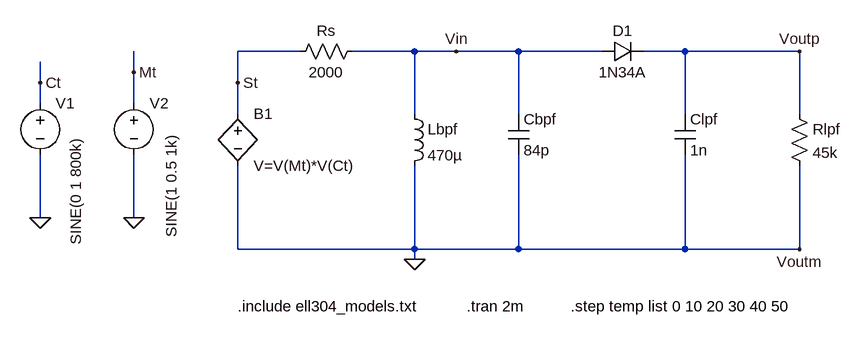
[diagram p0: schematic exmp2.asc]
exmp2.asc, the LTspice schematic file:
Version 4
SHEET 1 1368 680
WIRE 528 16 432 16
WIRE 704 16 608 16
WIRE 768 16 704 16
WIRE 864 16 768 16
WIRE 992 16 864 16
WIRE 1120 16 1056 16
WIRE 1296 16 1120 16
WIRE 272 48 272 16
WIRE 128 64 128 32
WIRE 432 64 432 16
WIRE 128 96 128 64
WIRE 272 96 272 48
WIRE 432 112 432 64
WIRE 704 112 704 16
WIRE 864 112 864 16
WIRE 1120 112 1120 16
WIRE 1296 112 1296 16
WIRE 128 272 128 176
WIRE 272 272 272 176
WIRE 432 320 432 192
WIRE 704 320 704 192
WIRE 704 320 432 320
WIRE 864 320 864 176
WIRE 864 320 704 320
WIRE 1120 320 1120 176
WIRE 1120 320 864 320
WIRE 1296 320 1296 192
WIRE 1296 320 1120 320
WIRE 704 336 704 320
FLAG 272 272 0
FLAG 128 272 0
FLAG 272 48 Mt
FLAG 128 64 Ct
FLAG 704 336 0
FLAG 1296 16 Voutp
FLAG 1296 320 Voutm
FLAG 432 64 St
FLAG 768 16 Vin
SYMBOL voltage 128 80 R0
WINDOW 3 55 69 VRight 2
WINDOW 123 0 0 Left 0
WINDOW 39 0 0 Left 0
SYMATTR Value SINE(0 1 800k)
SYMATTR InstName V1
SYMBOL voltage 272 80 R0
WINDOW 3 58 64 VRight 2
WINDOW 123 0 0 Left 0
WINDOW 39 0 0 Left 0
SYMATTR Value SINE(1 0.5 1k)
SYMATTR InstName V2
SYMBOL res 624 0 R90
WINDOW 0 0 56 VBottom 2
WINDOW 3 32 56 VTop 2
SYMATTR InstName Rs
SYMATTR Value 2000
SYMBOL ind 688 96 R0
SYMATTR InstName Lbpf
SYMATTR Value 470µ
SYMATTR SpiceLine Rser=10
SYMBOL cap 848 112 R0
SYMATTR InstName Cbpf
SYMATTR Value 84p
SYMBOL diode 992 32 R270
WINDOW 0 32 32 VTop 2
WINDOW 3 0 32 VBottom 2
SYMATTR InstName D1
SYMATTR Value 1N34A
SYMBOL cap 1104 112 R0
SYMATTR InstName Clpf
SYMATTR Value 1n
SYMBOL res 1280 96 R0
SYMATTR InstName Rlpf
SYMATTR Value 45k
SYMBOL bv 432 96 R0
SYMATTR InstName B1
SYMATTR Value V=V(Mt)*V(Ct)
TEXT 432 408 Left 2 !.include ell304_models.txt
TEXT 784 408 Left 2 !.tran 2m
TEXT 944 408 Left 2 !.step temp list 0 10 20 30 40 50

The netlist it stands for:
* exmp2.asc
V1 Ct 0 SINE(0 1 800k)
V2 Mt 0 SINE(1 0.5 1k)
Rs Vin St 2000
Lbpf Vin 0 470µ Rser=10
Cbpf Vin 0 84p
D1 Vin Voutp 1N34A
Clpf Voutp 0 1n
Rlpf Voutp 0 45k
B1 St 0 V=V(Mt)*V(Ct)
.model D D
.lib standard.dio
.include ell304_models.txt
.tran 2m
.step temp list 0 10 20 30 40 50
.backanno
.end